# Altium schematic sheet connector.SchDoc
size A3; PageSetup: Record=PageOptions|CenterHorizontal=True|CenterVertical=True|PrintScale=1.00|XCorrection=1.00|YCorrection=1.00|PrintKind=1|BorderSize=5000000|LeftOffset=0|BottomOffset=0|Orientation=2|PaperLength=1000|PaperWidth=1000|Scale=100|PaperSource=7|PrintQuality=-3|MediaType=1|DitherType=10|PrintScaleMode=1|PaperKind=A4|PaperIndex=9
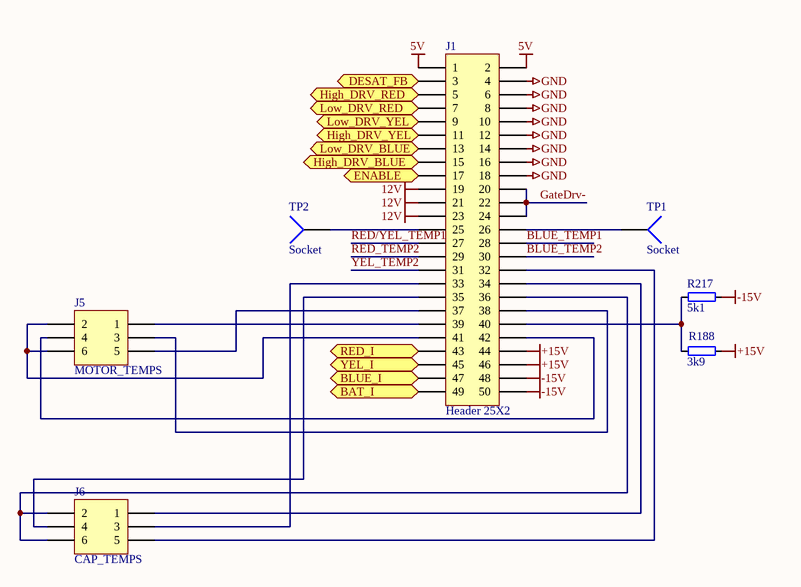
[diagram p0: connector.SchDoc]

## Parts
J1  Header 25X2  [HDR2X25]
J5  MOTOR_TEMPS  [HDR2X3]
J6  CAP_TEMPS  [HDR2X3]
R188  3k9  [0402]
R217  5k1  [0402]
TP1  Socket  [PIN1]
TP2  Socket  [PIN1]

## Ports
BAT_I, BLUE_I, DESAT_FB, ENABLE, High_DRV_BLUE, High_DRV_RED, High_DRV_YEL, Low_DRV_BLUE, Low_DRV_RED, Low_DRV_YEL, RED_I, YEL_I

## Nets
5V: J1.1 J1.2
12V: J1.19 J1.21 J1.23
+15V: J1.44 J1.46 R188.2
-15V: J1.48 J1.50 R217.2
GND: J1.4 J1.6 J1.8 J1.10 J1.12 J1.14 J1.16 J1.18
BAT_I: J1.49 ; port BAT_I
BLUE_I: J1.47 ; port BLUE_I
BLUE_TEMP1: J1.28
BLUE_TEMP2: J1.30
DESAT_FB: J1.3 ; port DESAT_FB
ENABLE: J1.17 ; port ENABLE
GateDrv-: J1.20 J1.22 J1.24
High_DRV_BLUE: J1.15 ; port High_DRV_BLUE
High_DRV_RED: J1.5 ; port High_DRV_RED
High_DRV_YEL: J1.11 ; port High_DRV_YEL
Low_DRV_BLUE: J1.13 ; port Low_DRV_BLUE
Low_DRV_RED: J1.7 ; port Low_DRV_RED
Low_DRV_YEL: J1.9 ; port Low_DRV_YEL
RED/YEL_TEMP1: J1.27
RED_I: J1.43 ; port RED_I
RED_TEMP2: J1.29
YEL_I: J1.45 ; port YEL_I
YEL_TEMP2: J1.31
NetJ1_25: J1.25 TP2.1
NetJ1_26: J1.26 TP1.1
NetJ1_32: J1.32 J6.5
NetJ1_33: J1.33 J6.3
NetJ1_34: J1.34 J6.1
NetJ1_35: J1.35 J6.4
NetJ1_36: J1.36 J6.2 J6.6
NetJ1_37: J1.37 J5.5
NetJ1_38: J1.38 J5.3
NetJ1_39: J1.39 J5.1
NetJ1_40: J1.40 R188.1 R217.1
NetJ1_41: J1.41 J5.2 J5.6
NetJ1_42: J1.42 J5.4

## Library data of the parts
J1 = Header 25X2: Header, 25-Pin, Dual row; LatestRevisionDate: 17-Jul-2002; LatestRevisionNote: Re-released for DXP Platform.; Publisher: Altium Limited
J5 J6 = Header 3X2: Header, 3-Pin, Dual row; LatestRevisionDate: 17-Jul-2002; LatestRevisionNote: Re-released for DXP Platform.; Publisher: Altium Limited
R188 R217 = RESISTOR: Parameter: *; Status: Draft
TP1 TP2 = Socket: LatestRevisionDate: 17-Jul-2002; LatestRevisionNote: Re-released for DXP Platform.; Publisher: Altium Limited